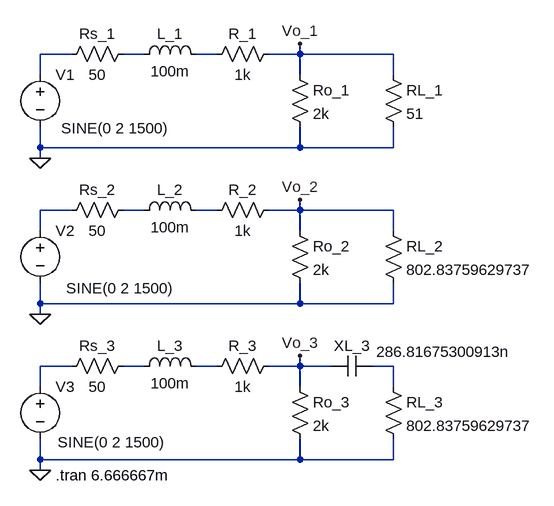
[diagram p0: schematic lab11.asc]
lab11.asc, the LTspice schematic file:
Version 4
SHEET 1 884 760
WIRE -48 80 -96 80
WIRE 64 80 32 80
WIRE 176 80 144 80
WIRE 304 80 304 64
WIRE 304 80 256 80
WIRE 448 80 304 80
WIRE -96 112 -96 80
WIRE 304 112 304 80
WIRE 448 112 448 80
WIRE -96 224 -96 192
WIRE 304 224 304 192
WIRE 304 224 -96 224
WIRE 448 224 448 192
WIRE 448 224 304 224
WIRE -96 240 -96 224
WIRE -48 320 -96 320
WIRE 64 320 32 320
WIRE 176 320 144 320
WIRE 304 320 304 304
WIRE 304 320 256 320
WIRE 448 320 304 320
WIRE -96 352 -96 320
WIRE 304 352 304 320
WIRE 448 352 448 320
WIRE -96 464 -96 432
WIRE 304 464 304 432
WIRE 304 464 -96 464
WIRE 448 464 448 432
WIRE 448 464 304 464
WIRE -96 480 -96 464
WIRE -48 560 -96 560
WIRE 64 560 32 560
WIRE 176 560 144 560
WIRE 304 560 304 544
WIRE 304 560 256 560
WIRE 352 560 304 560
WIRE 448 560 416 560
WIRE -96 592 -96 560
WIRE 304 592 304 560
WIRE 448 592 448 560
WIRE -96 704 -96 672
WIRE 304 704 304 672
WIRE 304 704 -96 704
WIRE 448 704 448 672
WIRE 448 704 304 704
WIRE -96 720 -96 704
FLAG -96 240 0
FLAG -96 480 0
FLAG -96 720 0
FLAG 304 64 Vo_1
FLAG 304 304 Vo_2
FLAG 304 544 Vo_3
SYMBOL voltage -96 96 R0
WINDOW 39 0 0 Left 2
WINDOW 3 32 98 Left 2
SYMATTR InstName V1
SYMATTR Value SINE(0 2 1500)
SYMBOL res -64 96 R270
WINDOW 0 32 56 VTop 2
WINDOW 3 0 56 VBottom 2
SYMATTR InstName Rs_1
SYMATTR Value 50
SYMBOL res 160 96 R270
WINDOW 0 32 56 VTop 2
WINDOW 3 0 56 VBottom 2
SYMATTR InstName R_1
SYMATTR Value 1k
SYMBOL res 288 96 R0
SYMATTR InstName Ro_1
SYMATTR Value 2k
SYMBOL ind 48 96 R270
WINDOW 0 32 56 VTop 2
WINDOW 3 5 56 VBottom 2
SYMATTR InstName L_1
SYMATTR Value 100m
SYMBOL res 432 96 R0
SYMATTR InstName RL_1
SYMATTR Value 51
SYMBOL voltage -96 336 R0
WINDOW 39 0 0 Left 2
WINDOW 3 40 104 Left 2
SYMATTR InstName V2
SYMATTR Value SINE(0 2 1500)
SYMBOL res -64 336 R270
WINDOW 0 32 56 VTop 2
WINDOW 3 0 56 VBottom 2
SYMATTR InstName Rs_2
SYMATTR Value 50
SYMBOL res 160 336 R270
WINDOW 0 32 56 VTop 2
WINDOW 3 0 56 VBottom 2
SYMATTR InstName R_2
SYMATTR Value 1k
SYMBOL res 288 336 R0
SYMATTR InstName Ro_2
SYMATTR Value 2k
SYMBOL ind 48 336 R270
WINDOW 0 32 56 VTop 2
WINDOW 3 5 56 VBottom 2
SYMATTR InstName L_2
SYMATTR Value 100m
SYMBOL res 432 336 R0
SYMATTR InstName RL_2
SYMATTR Value 802.83759629737
SYMBOL voltage -96 576 R0
WINDOW 39 0 0 Left 2
WINDOW 3 27 101 Left 2
SYMATTR InstName V3
SYMATTR Value SINE(0 2 1500)
SYMBOL res -64 576 R270
WINDOW 0 32 56 VTop 2
WINDOW 3 0 56 VBottom 2
SYMATTR InstName Rs_3
SYMATTR Value 50
SYMBOL res 160 576 R270
WINDOW 0 32 56 VTop 2
WINDOW 3 0 56 VBottom 2
SYMATTR InstName R_3
SYMATTR Value 1k
SYMBOL res 288 576 R0
SYMATTR InstName Ro_3
SYMATTR Value 2k
SYMBOL ind 48 576 R270
WINDOW 0 32 56 VTop 2
WINDOW 3 5 56 VBottom 2
SYMATTR InstName L_3
SYMATTR Value 100m
SYMBOL res 432 576 R0
SYMATTR InstName RL_3
SYMATTR Value 802.83759629737
SYMBOL cap 352 576 R270
WINDOW 0 32 32 VTop 2
WINDOW 3 54 174 VBottom 2
SYMATTR InstName XL_3
SYMATTR Value 286.81675300913n
TEXT -72 728 Left 2 !.tran 6.666667m

The netlist it stands for:
* lab11.asc
V1 N001 0 SINE(0 2 1500)
Rs_1 N001 N002 50
R_1 N003 Vo_1 1k
Ro_1 Vo_1 0 2k
L_1 N002 N003 100m
RL_1 Vo_1 0 51
V2 N004 0 SINE(0 2 1500)
Rs_2 N004 N005 50
R_2 N006 Vo_2 1k
Ro_2 Vo_2 0 2k
L_2 N005 N006 100m
RL_2 Vo_2 0 802.83759629737
V3 N007 0 SINE(0 2 1500)
Rs_3 N007 N008 50
R_3 N009 Vo_3 1k
Ro_3 Vo_3 0 2k
L_3 N008 N009 100m
RL_3 N010 0 802.83759629737
C§XL_3 Vo_3 N010 286.81675300913n
.tran 6.666667m
.backanno
.end

* Results of the author's LTspice run, read from the files saved beside the schematic
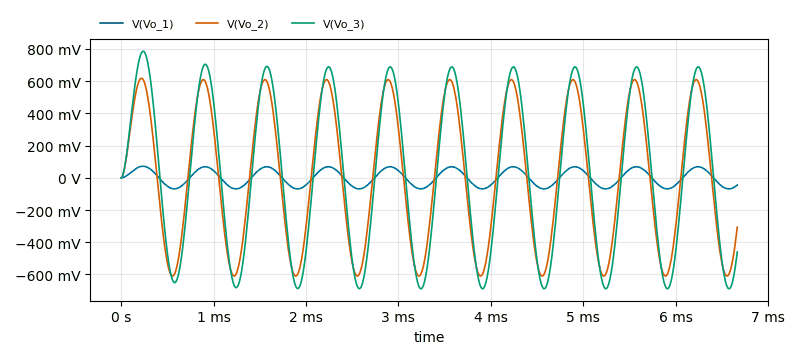
[diagram p1: Transient Analysis of lab11.asc, plotted from the saved traces]
* Transient Analysis, 1 run:
*   V(Vo_1): min -68.6 mV, max 71.75 mV, average 610.5 µV, rms 48.65 mV, last -44.69 mV
*   V(Vo_2): min -609.9 mV, max 618.2 mV, average 2.842 mV, rms 431.7 mV, last -306.6 mV
*   V(Vo_3): min -689.1 mV, max 785.6 mV, average 12.71 mV, rms 490.7 mV, last -460.8 mV